# Altium project nixie_tube_adapter.PrjPcb
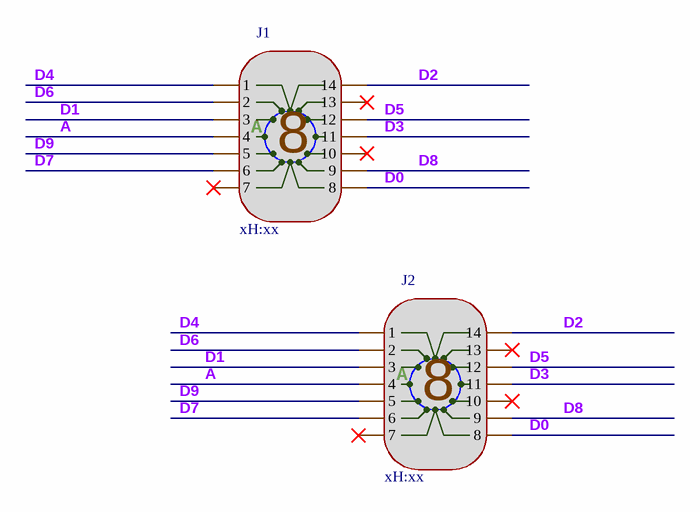
[diagram p0: main.SchDoc]
pcb_2_dec_tol: +/-.01; pcb_3_dec_tol: +/-.010; pcb_address1: Via San Quirico 233/3; pcb_address2: 50013 Campi Bisenzio; pcb_address3: Firenze; pcb_address4: ITALIA; pcb_ang_tol: +/-1/2; pcb_checker: - -----; pcb_checker_app_date: --/--/----; pcb_designer: - -----; pcb_designer_app_date: --/--/----; pcb_dwg_no: <PCB DWG NO>; pcb_engineer: - -----; pcb_engineer_app_date: --/--/----; pcb_finish: HASL; pcb_layer_count: 2; pcb_material: FR4-Standard Tg 130-140C; pcb_organization: Develer srl; pcb_scale: 1:1; pcb_stackup: Default; pcb_title1: <TITLE 1>; pcb_title2: <TITLE 2>; prj_date: --/--/----; prj_hw_ver: 0; prj_license: DB Home Copyright; prj_name: nixie_clock_tubes; prj_name_long: Nixie Clock Tubes; prj_panel_name: nixie_clock_tubes_panel; prj_part_number: <PCB PN>; prj_pcb: A; prj_status: Prototype
1 sheet, 2 parts. Net scope: hierarchical (ports join the sheet entries above them; power ports are global).
Board files: nixi_tube.PcbDoc, nixi_tube_adapter.PcbDoc

## Sheet main.SchDoc
size A3; Hw_rev: R1; Address3: Firenze; Address4: ITALY; Revision: 0; SheetNumber: 2; SheetTotal: 2

### Parts
J1  xH:xx  [SOCKET_NIXI_TUBE]
J2  xH:xx  [SOCKET_NIXI_TUBE_D18]

### Nets
A: J1.4 J2.4
D0: J1.8 J2.8
D1: J1.3 J2.3
D2: J1.14 J2.14
D3: J1.11 J2.11
D4: J1.1 J2.1
D5: J1.12 J2.12
D6: J1.2 J2.2
D7: J1.6 J2.6
D8: J1.9 J2.9
D9: J1.5 J2.5

Not connected (* = marked no-connect by the designer): J1 7* 10* 13*; J2 7* 10* 13*

### Notes on the sheet
- Title:
- Project:
- Desc:
- Variant:
- File:
- License:
- asterix24@gmail.com
- Ing. Daniele Basile
- Rev:
- Prj Rev:
- Status:
- Size:
- Date:
- Time:
- Sheet
- of
- A3
- (in symbol NIXIE_TUBE_SOCKET_14PIN_31MM_THD) A

### Library data of the parts
J1 J2 = NIXIE_TUBE_SOCKET_14PIN_31MM_THD: Publisher: Develer srl; Revision: 0.1; NOTE Manufacturer PN: *; NOTE Manufacturer: *; MountTechnology: SMT; CODE Develer: *; NOTE Description: *; NOTE Description 2: *